# Altium project IoTNode.PrjPCB
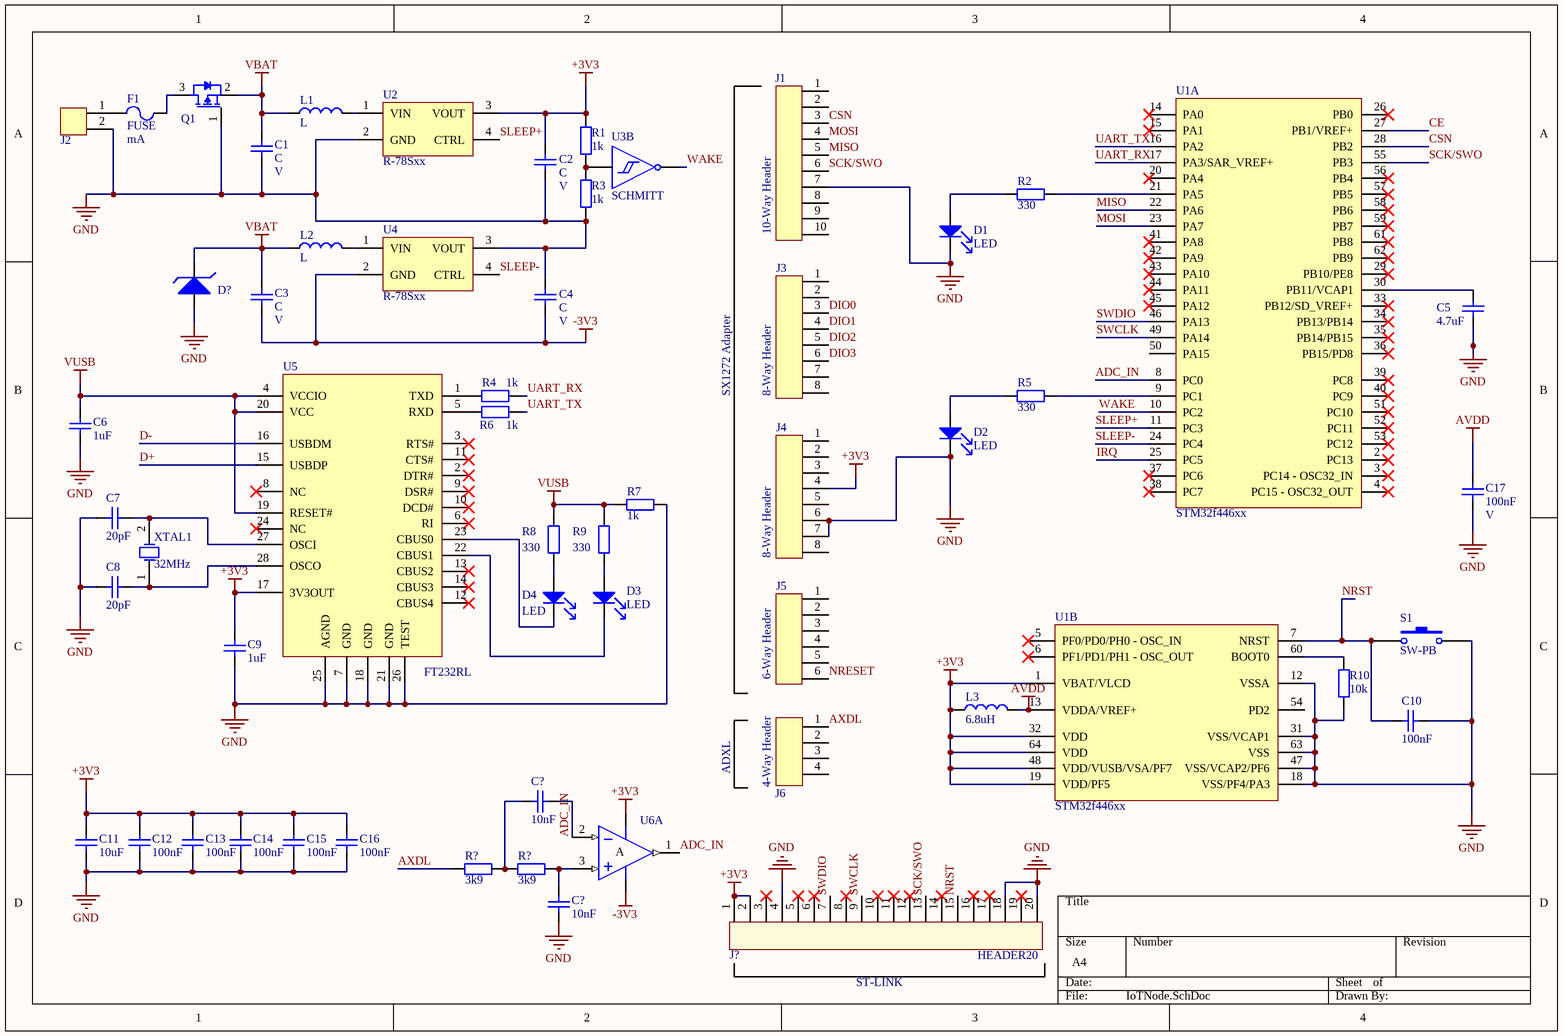
[diagram p0: IoTNode.SchDoc]
1 sheet, 56 parts. Net scope: global (net labels, ports and power ports of the same name join across sheets).

## Sheet IoTNode.SchDoc
size A4

### Parts
(Parts that share a designator on the sheet are numbered #1, #2 ... from top to bottom, then left to right.)
C1  value C  Voltage Rating: V  [0805]  (hidden comment: CAPACITOR)
C2  value C  Voltage Rating: V  [0805]  (hidden comment: CAPACITOR)
C3  value C  Voltage Rating: V  [0805]  (hidden comment: CAPACITOR)
C4  value C  Voltage Rating: V  [0805]  (hidden comment: CAPACITOR)
C5  value 4.7uF  [0603]  (hidden comment: CAPACITOR)
C6  value 1uF  [0603]  (hidden comment: CAPACITOR)
C7  value 20pF  [0603]  (hidden comment: CAPACITOR)
C8  value 20pF  [0603]  (hidden comment: CAPACITOR)
C9  value 1uF  [0603]  (hidden comment: CAPACITOR)
C10  value 100nF  [0603]  (hidden comment: CAPACITOR)
C11  value 10uF  [0603]  (hidden comment: CAPACITOR)
C12  value 100nF  [0603]  (hidden comment: CAPACITOR)
C13  value 100nF  [0603]  (hidden comment: CAPACITOR)
C14  value 100nF  [0603]  (hidden comment: CAPACITOR)
C15  value 100nF  [0603]  (hidden comment: CAPACITOR)
C16  value 100nF  [0603]  (hidden comment: CAPACITOR)
C17  value 100nF  Voltage Rating: V  [0603]  (hidden comment: CAPACITOR)
C?#1  value 10nF  [0603]  (hidden comment: CAPACITOR)
C?#2  value 10nF  [0603]  (hidden comment: CAPACITOR)
D1  LED  [0805-LED]
D2  LED  [0805-LED]
D3  LED  [0805-LED]
D4  LED  [0805-LED]
D?  ZENER DIODE  [SOT233]  (value not drawn)
F1  FUSE  Rating: mA  [FUSE6.3x32]
J1  10-Way Header  [HEADER10F]
J2  2-Way Header  [KK2542]  (value not drawn)
J3  8-Way Header  [PICOSPOX8]
J4  8-Way Header  [PICOSPOX8]
J5  6-Way Header  [HEADER6]
J6  4-Way Header  [KK2544]
J?  HEADER20  [Hirose 20POS SMD Female]
L1  value L  [NPI75]  (hidden comment: INDUCTOR)
L2  value L  [NPI75]  (hidden comment: INDUCTOR)
L3  value 6.8uH  [1008L]  (hidden comment: INDUCTOR)
Q1  P-Channel FET  [SOT233]  (value not drawn)
R1  value 1k  [0603]  (hidden comment: RESISTOR)
R2  value 330  [0603]  (hidden comment: RESISTOR)
R3  value 1k  [0603]  (hidden comment: RESISTOR)
R4  value 1k  [0603]  (hidden comment: RESISTOR)
R5  value 330  [0603]  (hidden comment: RESISTOR)
R6  value 1k  [0603]  (hidden comment: RESISTOR)
R7  value 1k  [0805]  (hidden comment: RESISTOR)
R8  value 330  [0805]  (hidden comment: RESISTOR)
R9  value 330  [0805]  (hidden comment: RESISTOR)
R10  value 10k  [0603]  (hidden comment: RESISTOR)
R?#1  value 3k9  [0805]  (hidden comment: RESISTOR)
R?#2  value 3k9  [0805]  (hidden comment: RESISTOR)
S1  SW-PB  [LSH-SMD]
U1  STM32f446xx  [LQFP64]  (parts A,B of 2)
U2  R-78Sxx  [RECOM R-78S]
U3  SCHMITT  [TSSOP14]  (part B of 7)
U4  R-78Sxx  [RECOM R-78S]
U5  FT232RL  [SSOP28]
U6  Op Amp  [SOIC8]  (value not drawn)  (part A of 2)
XTAL1  32MHz  [HC49S]

### Nets
+3V3: C2.2 C9.2 C11.2 C12.2 C13.2 C14.2 C15.2 C16.2 J4.4 J?.1 J?.2 L3.2 R1.2 U1.1(VBAT/VLCD) U1.19(VDD/PF5) U1.32(VDD) U1.48(VDD/VUSB/VSA/PF7) U1.64(VDD) U2.3(VOUT) U5.17(3V3OUT) U6.8
-3V3: C3.1 C4.1 U4.2(GND) U6.4
AVDD: C17.2 L3.1 U1.13(VDDA/VREF+)
GND: C1.1 C2.1 C4.2 C5.1 C6.1 C7.2 C8.2 C9.1 C10.1 C11.1 C12.1 C13.1 C14.1 C15.1 C16.1 C17.1 C?#2.1 D1.2(Cathode) D2.2(Cathode) D?.1(A) J1.7 J2.2 J4.6 J4.7 J?.4 J?.18 J?.20 Q1.1(G) R3.1 R7.1 R10.1 S1.2 U1.12(VSSA) U1.18(VSS/PF4/PA3) U1.31(VSS/VCAP1) U1.47(VSS/VCAP2/PF6) U1.63(VSS) U2.2(GND) U4.3(VOUT) U5.7(GND) U5.18(GND) U5.21(GND) U5.25(AGND) U5.26(TEST)
VBAT: C1.2 C3.2 D?.2(K) L1.2 L2.2 Q1.2
VUSB: C6.2 R7.2 R8.2 R9.2 U5.4(VCCIO) U5.19(RESET#) U5.20(VCC)
ADC_IN: C?#1.1 U1.8(PC0) U6.1(OUT) U6.2(IN-)
AXDL: J6.1 R?#1.2
CE: U1.27(PB1/VREF+)
CSN: J1.3 U1.28(PB2)
D+: U5.15(USBDP)
D-: U5.16(USBDM)
DIO0: J3.3
DIO1: J3.4
DIO2: J3.5
DIO3: J3.6
IRQ: U1.25(PC5)
MISO: J1.5 U1.22(PA6)
MOSI: J1.4 U1.23(PA7)
NRESET: J5.6
NRST: C10.2 J?.15 S1.1 U1.7(NRST)
SCK/SWO: J1.6 J?.13 U1.55(PB3)
SLEEP+: U1.11(PC3) U2.4(CTRL)
SLEEP-: U1.24(PC4) U4.4(CTRL)
SWCLK: J?.9 U1.49(PA14)
SWDIO: J?.7 U1.46(PA13)
UART_RX: R4.2 U1.17(PA3/SAR_VREF+)
UART_TX: R6.2 U1.16(PA2)
WAKE: U1.10(PC2) U3.4
NetC5_2: C5.2 U1.30(PB11/VCAP1)
NetC7_1: C7.1 U5.27(OSCI) XTAL1.2(OSC2)
NetC8_1: C8.1 U5.28(OSCO) XTAL1.1(OSC1)
NetC?#1_2: C?#1.2 R?#1.1 R?#2.2
NetC?#2_2: C?#2.2 R?#2.1 U6.3(IN+)
NetD1_1: D1.1(Anode) R2.1
NetD2_1: D2.1(Anode) R5.1
NetD3_1: D3.1(Anode) R9.1
NetD3_2: D3.2(Cathode) U5.22(CBUS1)
NetD4_1: D4.1(Anode) R8.1
NetD4_2: D4.2(Cathode) U5.23(CBUS0)
NetF1_1: F1.1 J2.1
NetF1_2: F1.2 Q1.3(D)
NetL1_1: L1.1 U2.1(VIN)
NetL2_1: L2.1 U4.1(VIN)
NetR1_1: R1.1 R3.2 U3.3
NetR2_2: R2.2 U1.21(PA5)
NetR4_1: R4.1 U5.1(TXD)
NetR5_2: R5.2 U1.9(PC1)
NetR6_1: R6.1 U5.5(RXD)
NetR10_2: R10.2 U1.60(BOOT0)

Not connected (* = marked no-connect by the designer): J1 1 2 8 9 10; J3 1 2 7 8; J4 1 2 3 5 8; J5 1 2 3 4 5; J6 2 3 4; J? 3* 5* 6* 8* 10* 11* 12* 14* 16* 17* 19*; U1 2(PC13)* 3(PC14_-_OSC32_IN)* 4(PC15_-_OSC32_OUT)* 5(PF0/PD0/PH0_-_OSC_IN)* 6(PF1/PD1/PH1_-_OSC_OUT)* 14(PA0)* 15(PA1)* 20(PA4)* 26(PB0)* 29(PB10/PE8)* 33(PB12/SD_VREF+)* 34(PB13/PB14)* 35(PB14/PB15)* 36(PB15/PD8)* 37(PC6)* 38(PC7)* 39(PC8)* 40(PC9)* 41(PA8)* 42(PA9)* 43(PA10)* 44(PA11)* 45(PA12)* 50(PA15) 51(PC10)* 52(PC11)* 53(PC12)* 54(PD2) 56(PB4)* 57(PB5)* 58(PB6)* 59(PB7)* 61(PB8)* 62(PB9)*; U5 2(DTR#)* 3(RTS#)* 6(RI)* 8(NC)* 9(DSR#)* 10(DCD#)* 11(CTS#)* 12(CBUS4)* 13(CBUS2)* 14(CBUS3)* 24(NC)*

### Notes on the sheet
- SX1272 Adapter
- ADXL
- ST-LINK
- (in symbol Op-Amp - LM358_1, part A) A

### Library data of the parts
C5-C16 C?#1 C?#2 = CAPACITOR: Voltage Rating: V
D? = ZENER DIODE: pin to pad: 2>3
J1 = HEADER10
J2 = HEADER2
J3 J4 = HEADER8
J5 = HEADER6
J6 = HEADER4
J? = HEADER20: 20-Way Header
Q1 = P-CHANNEL
S1 = SW-PB: Switch; Digikey Part No.: CKN9084CT-ND
U2 U4 = R-78Sxx: RECOM DC/DC Converter Low Power
U3 = SCHMITT: Schmitt Trigger
U5 = FT232R_1: USB UART IC
U6 = Op-Amp - LM358_1: LM358; Supplier 1: Digi-Key; Supplier Part Number 1: 497-1591-1-ND
XTAL1 = XTAL: Crystal Oscillator